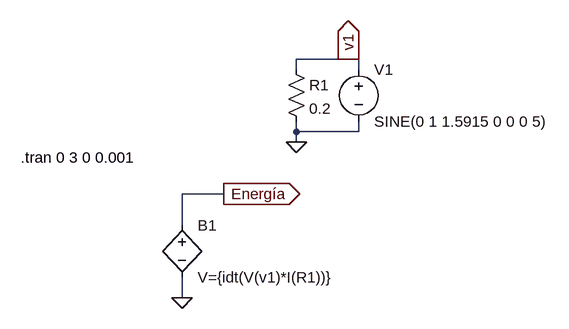
[diagram p0: schematic g1_p4.asc]
g1_p4.asc, the LTspice schematic file:
Version 4.1
SHEET 1 880 680
WIRE 272 96 192 96
WIRE 288 96 272 96
WIRE 192 112 192 96
WIRE 288 112 288 96
WIRE 192 208 192 192
WIRE 288 208 288 192
WIRE 288 208 192 208
WIRE 192 224 192 208
WIRE 80 304 16 304
WIRE 16 352 16 304
WIRE 16 464 16 432
FLAG 192 224 0
FLAG 272 96 v1
IOPIN 272 96 Out
FLAG 16 464 0
FLAG 80 304 Energía
IOPIN 80 304 Out
DATAFLAG 288 96 ""
SYMBOL voltage 288 96 R0
WINDOW 123 0 0 Left 0
WINDOW 39 0 0 Left 0
SYMATTR InstName V1
SYMATTR Value SINE(0 1 1.5915 0 0 0 5)
SYMBOL res 176 96 R0
SYMATTR InstName R1
SYMATTR Value 0.2
SYMBOL bv 16 336 R0
SYMATTR InstName B1
SYMATTR Value V={idt(V(v1)*I(R1))}
TEXT -232 248 Left 2 !.tran 0 3 0 0.001

The netlist it stands for:
* g1_p4.asc
V1 v1 0 SINE(0 1 1.5915 0 0 0 5)
R1 v1 0 0.2
B1 Energía 0 V={idt(V(v1)*I(R1))}
.tran 0 3 0 0.001
.backanno
.end